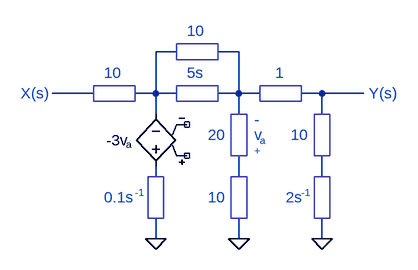
[diagram p0: schematic g2s.asc]
g2s.asc, the LTspice schematic file:
Version 4
SHEET 1 1080 680
WIRE 304 160 272 160
WIRE 400 160 368 160
WIRE 176 224 112 224
WIRE 272 224 272 160
WIRE 272 224 240 224
WIRE 304 224 272 224
WIRE 400 224 400 160
WIRE 400 224 368 224
WIRE 432 224 400 224
WIRE 528 224 496 224
WIRE 592 224 528 224
WIRE 272 256 272 224
WIRE 400 256 400 224
WIRE 528 256 528 224
WIRE 272 352 272 336
WIRE 400 352 400 320
WIRE 528 352 528 320
WIRE 272 448 272 416
WIRE 400 448 400 416
WIRE 528 448 528 416
FLAG 528 448 0
FLAG 400 448 0
FLAG 272 448 0
SYMBOL e 272 352 R180
WINDOW 0 42 56 Left 2
WINDOW 3 37 50 Left 1
SYMATTR InstName -3v
SYMATTR Value a
TEXT 192 192 Left 2 ;10
TEXT 600 224 Left 2 ;Y(s)
TEXT 456 192 Left 2 ;1
TEXT 192 384 Left 2 ;0.1s
TEXT 352 384 Left 2 ;10
TEXT 64 224 Left 2 ;X(s)
TEXT 320 192 Left 2 ;5s
TEXT 480 288 Left 2 ;10
TEXT 472 384 Left 2 ;2s
TEXT 496 376 Left 1 ;-1
TEXT 240 376 Left 1 ;-1
TEXT 320 128 Left 2 ;10
TEXT 352 288 Left 2 ;20
TEXT 424 264 Left 2 ;-
TEXT 424 312 Left 1 ;+
TEXT 424 288 Left 2 ;v
TEXT 432 296 Left 1 ;a
RECTANGLE Normal 496 212 432 236
RECTANGLE Normal 240 212 176 236
RECTANGLE Normal 368 212 304 236
RECTANGLE Normal 368 148 304 172
RECTANGLE Normal 388 256 412 320
RECTANGLE Normal 388 352 412 416
RECTANGLE Normal 260 352 284 416
RECTANGLE Normal 516 256 540 320
RECTANGLE Normal 516 352 540 416

The netlist it stands for:
* g2s.asc
E§-3v N005 N001 NC_01 NC_02 a
* 10
* Y(s)
* 1
* 0.1s
* 10
* X(s)
* 5s
* 10
* 2s
* -1
* -1
* 10
* 20
* -
* +
* v
* a
.backanno
.end